# EAGLE design Davininci (EAGLE 5.04)
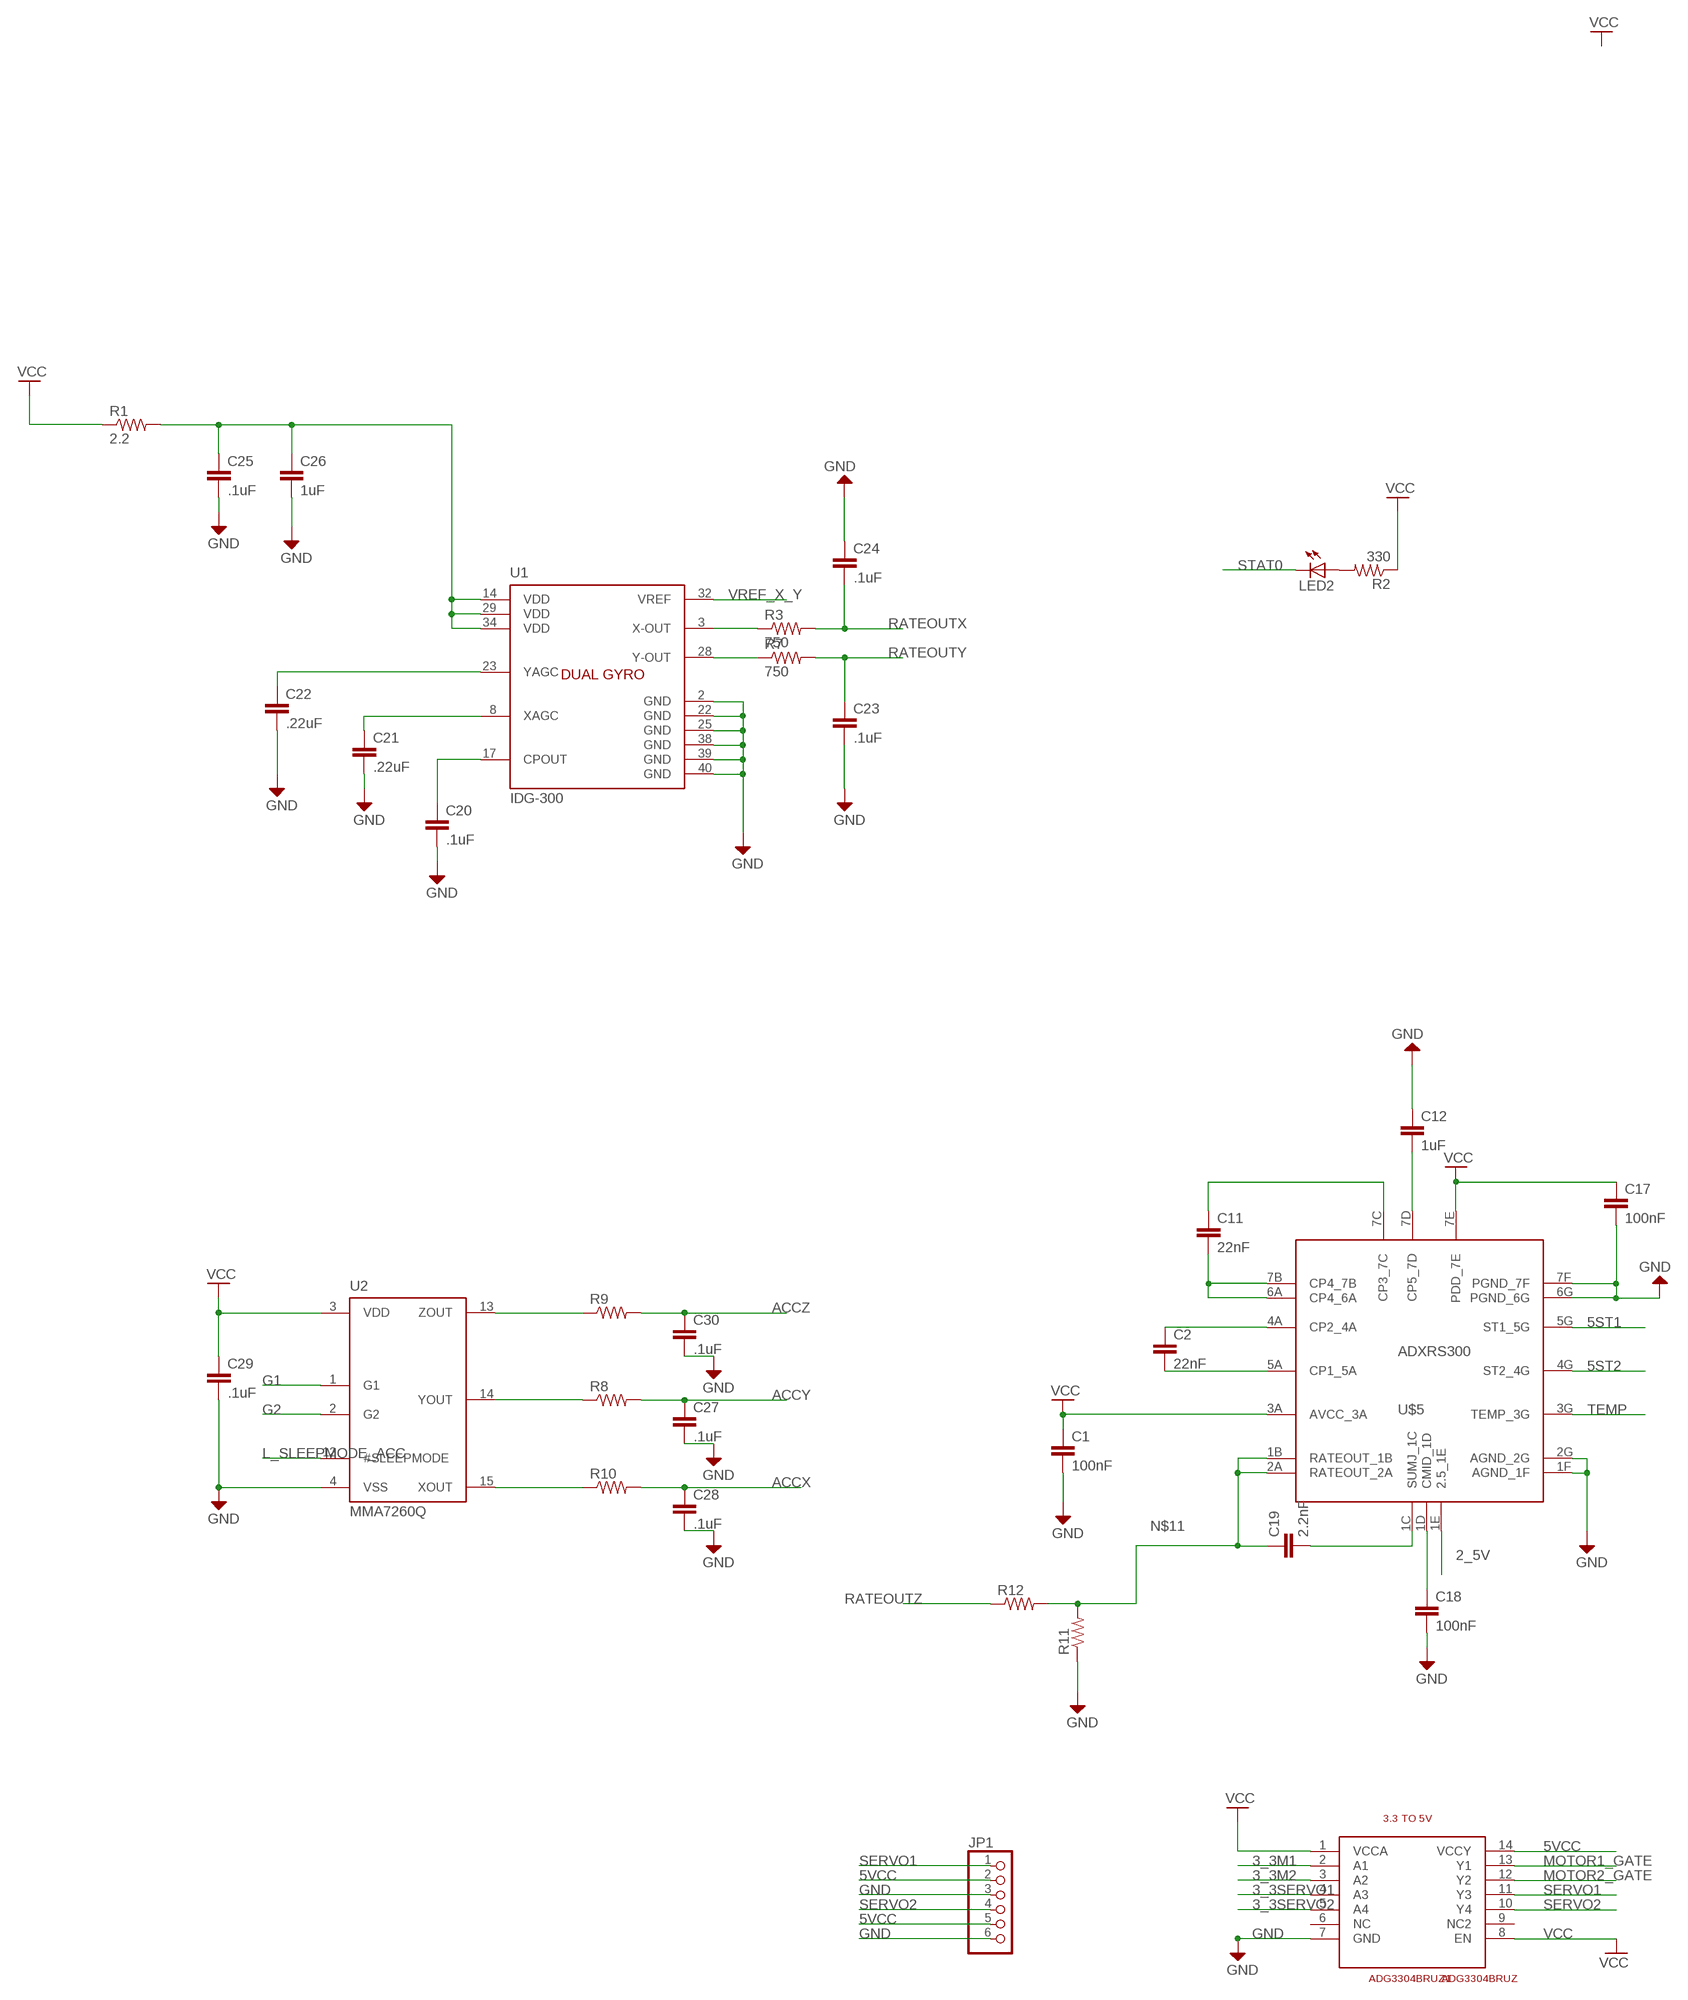
[diagram p0: schematic, sheet 1, part 1 of 2]
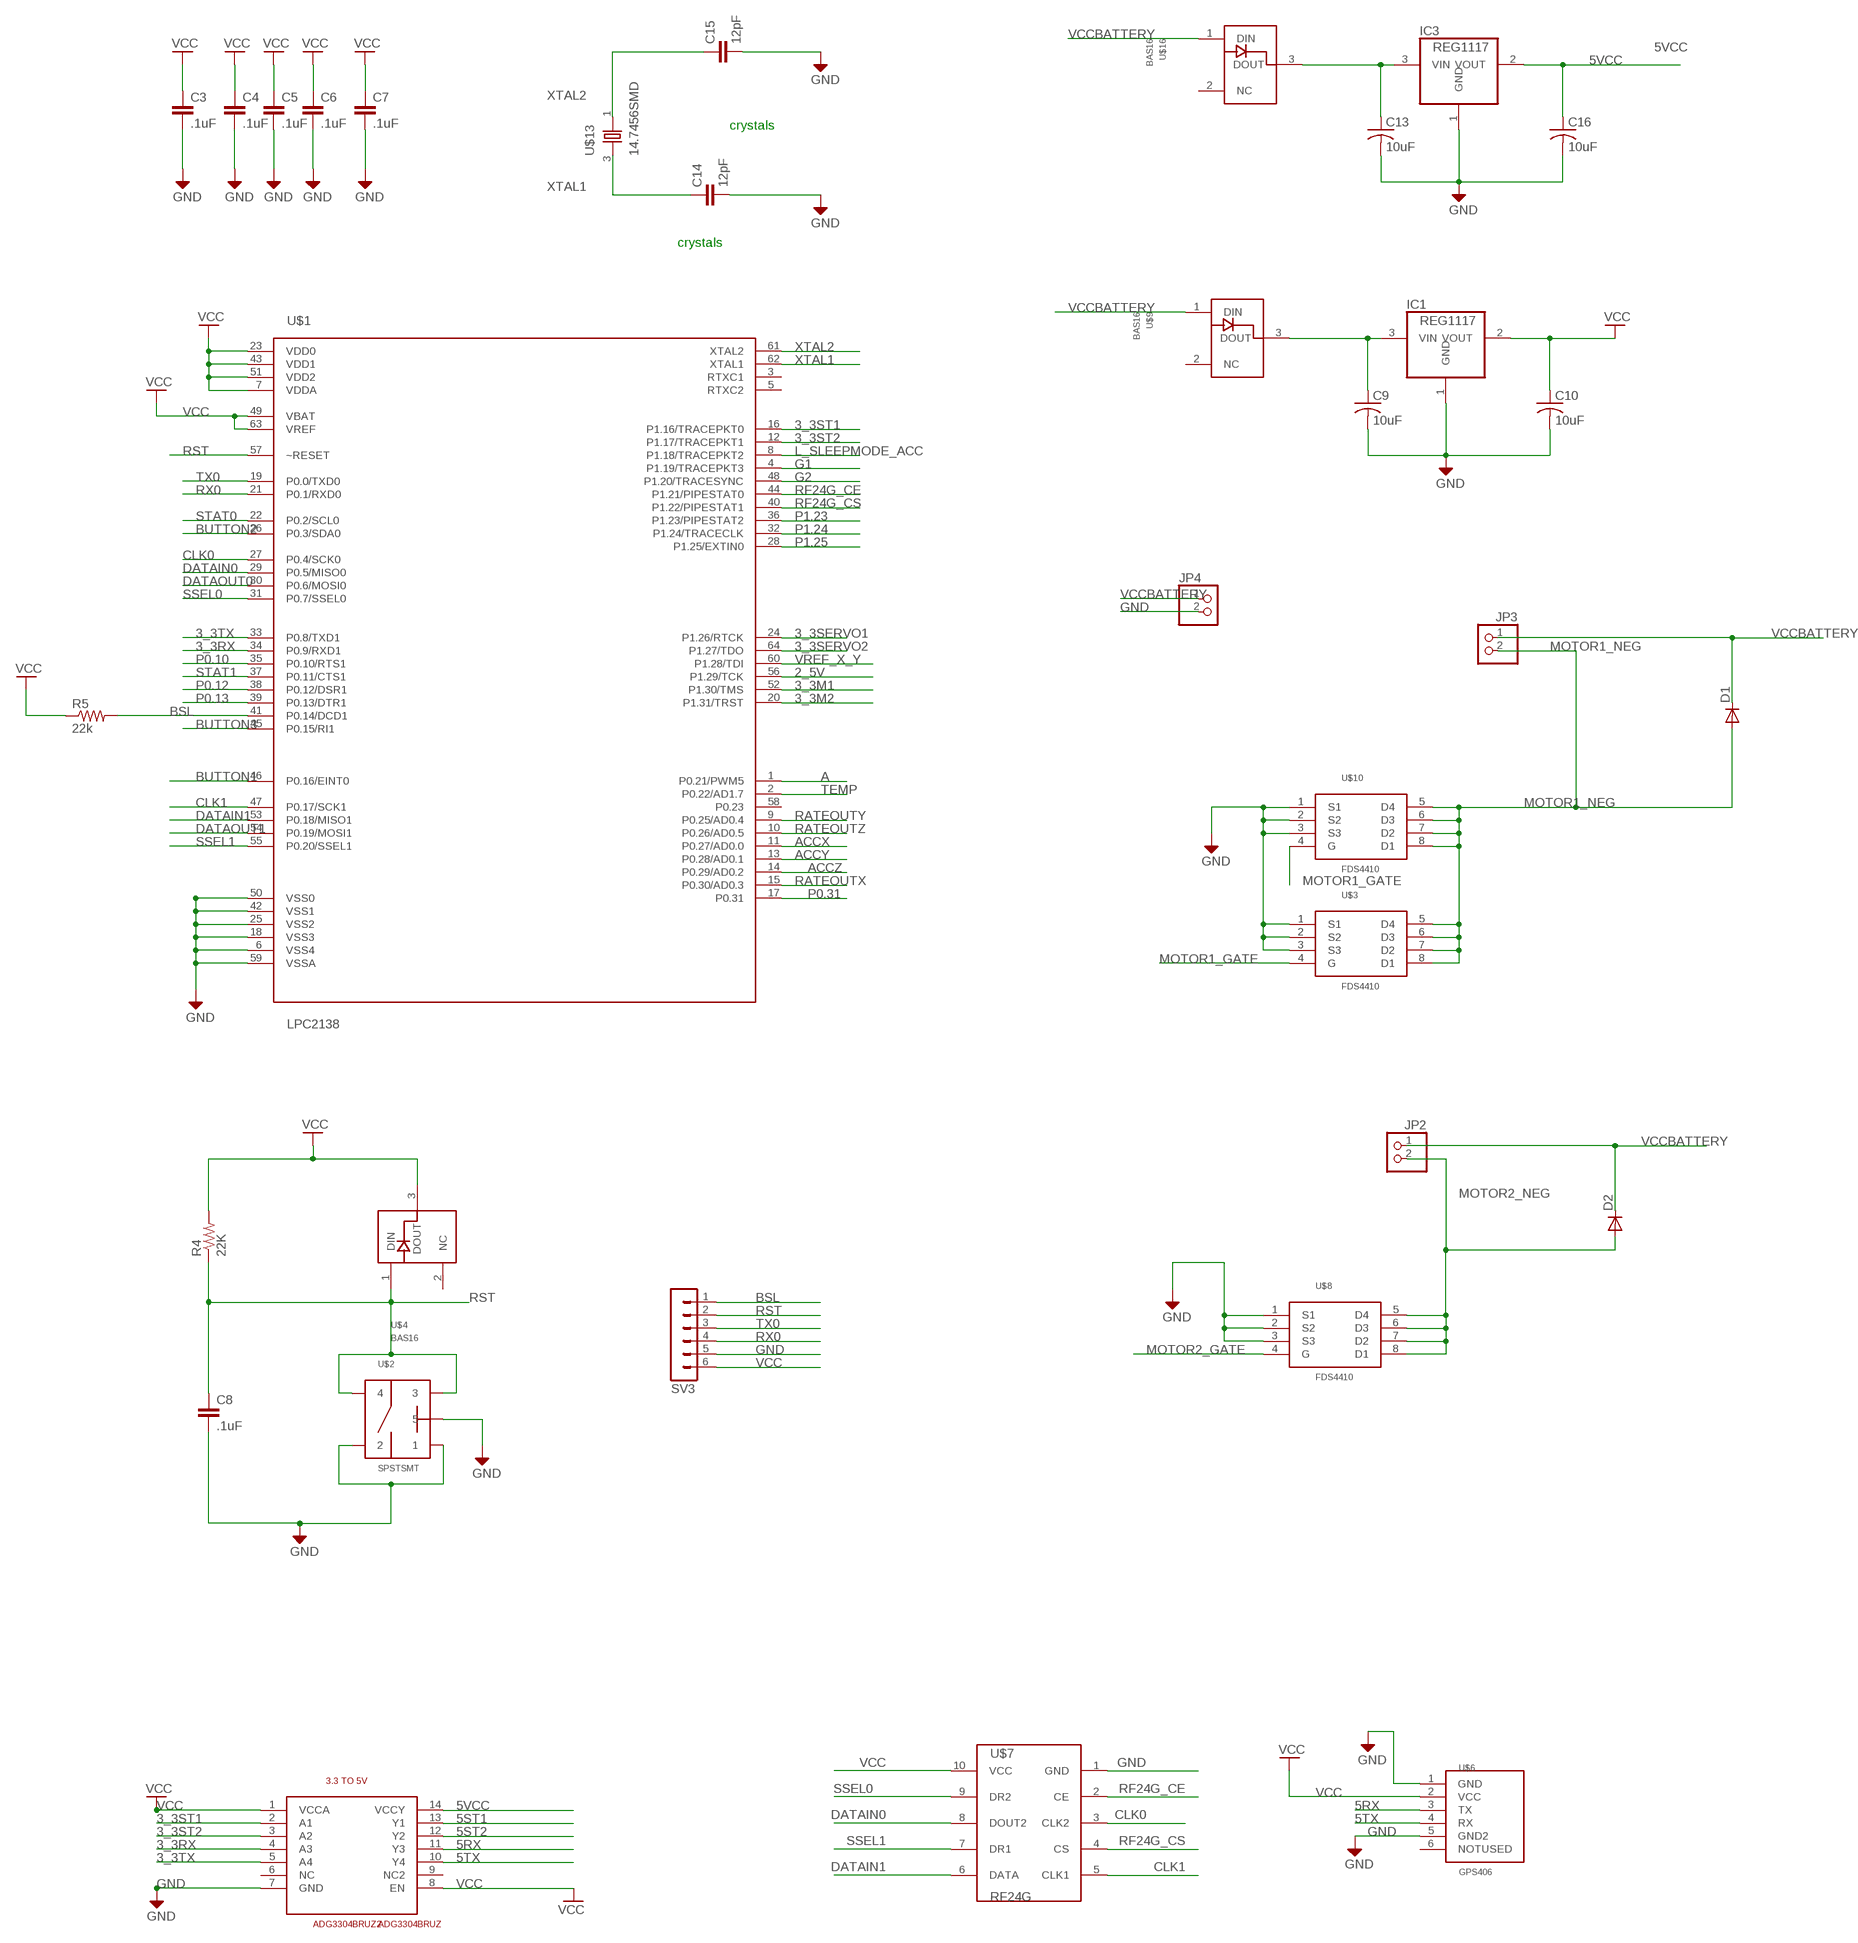
[diagram p1: schematic, sheet 1, part 2 of 2]

## Parts
ADG3304BRUZ1  ADG3304BRUZ  [TSSOP14]
ADG3304BRUZ2  ADG3304BRUZ  [TSSOP14]
C1  100nF  C-EUC0402  [C0402]
C2  22nF  C-EUC0402  [C0402]
C3  .1uF  C-EUC0402  [C0402]
C4  .1uF  C-EUC0402  [C0402]
C5  .1uF  C-EUC0402  [C0402]
C6  .1uF  C-EUC0402  [C0402]
C7  .1uF  C-EUC0402  [C0402]
C8  .1uF  C-EUC0402  [C0402]
C9  10uF  C-USC1206  [C1206]
C10  10uF  C-USC1206  [C1206]
C11  22nF  C-EUC0402  [C0402]
C12  1uF  C-EUC0402  [C0402]
C13  10uF  C-USC1206  [C1206]
C14  12pF  C-EUC0603  [C0603]
C15  12pF  C-EUC0603  [C0603]
C16  10uF  C-USC1206  [C1206]
C17  100nF  C-EUC0402  [C0402]
C18  100nF  C-EUC0402  [C0402]
C19  2.2nF  C-EUC0402  [C0402]
C20  .1uF  C-EUC0402  [C0402]
C21  .22uF  C-EUC0402  [C0402]
C22  .22uF  C-EUC0402  [C0402]
C23  .1uF  C-EUC0402  [C0402]
C24  .1uF  C-EUC0402  [C0402]
C25  .1uF  C-EUC0402  [C0402]
C26  1uF  C-EUC0402  [C0402]
C27  .1uF  C-EUC0402  [C0402]
C28  .1uF  C-EUC0402  [C0402]
C29  .1uF  C-EUC0402  [C0402]
C30  .1uF  C-EUC0402  [C0402]
D1  DIODE-DO214AC  [DO214AC]
D2  DIODE-DO214AC  [DO214AC]
IC1  REG1117  [SOT223]
IC3  REG1117  [SOT223]
JP1  PINHD-1X6  [1X06]
JP2  PINHD-1X2  [1X02]
JP3  PINHD-1X2  [1X02]
JP4  PINHD-1X2  [1X02]
LED2  LEDSMT1206  [1206]
R1  2.2  R-US_R0603  [R0603]
R2  330  R-US_R0603  [R0603]
R3  750  R-US_R0603  [R0603]
R4  22K  R-US_R0603  [R0603]
R5  22k  R-US_R0603  [R0603]
R7  750  R-US_R0603  [R0603]
R8  R-US_R0402  [R0402]
R9  R-US_R0402  [R0402]
R10  R-US_R0402  [R0402]
R11  R-US_R0402  [R0402]
R12  R-US_R0402  [R0402]
SV3  MA06-1  [MA06-1]
U1  IDG-300  [QFN-40]
U2  MMA7260Q  [QFN-16]
U$1  LPC2138  [LQFP64]
U$2  SPSTSMT  [SPSTSMT]
U$3  FDS4410  [SO-8]
U$4  BAS16  [SOT23]
U$5  ADXRS300  [CSPBGA_32]
U$6  GPS406  [GPS406CON]
U$7  RF24G  [RF24GCON]
U$8  FDS4410  [SO-8]
U$9  BAS16  [SOT23]
U$10  FDS4410  [SO-8]
U$13  14.7456SMD  [14.7456SMD]
U$16  BAS16  [SOT23]

## Nets
2_5V: U$1.56(P1.29/TCK) U$5.1E(2.5_1E)
3_3M1: ADG3304BRUZ1.2(A1) U$1.52(P1.30/TMS)
3_3M2: ADG3304BRUZ1.3(A2) U$1.20(P1.31/TRST)
3_3RX: ADG3304BRUZ2.4(A3) U$1.34(P0.9/RXD1)
3_3SERVO1: ADG3304BRUZ1.4(A3) U$1.24(P1.26/RTCK)
3_3SERVO2: ADG3304BRUZ1.5(A4) U$1.64(P1.27/TDO)
3_3ST1: ADG3304BRUZ2.2(A1) U$1.16(P1.16/TRACEPKT0)
3_3ST2: ADG3304BRUZ2.3(A2) U$1.12(P1.17/TRACEPKT1)
3_3TX: ADG3304BRUZ2.5(A4) U$1.33(P0.8/TXD1)
5RX: ADG3304BRUZ2.11(Y3) U$6.3(TX)
5ST1: ADG3304BRUZ2.13(Y1) U$5.5G(ST1_5G)
5ST2: ADG3304BRUZ2.12(Y2) U$5.4G(ST2_4G)
5TX: ADG3304BRUZ2.10(Y4) U$6.4(RX)
5VCC: ADG3304BRUZ1.14(VCCY) ADG3304BRUZ2.14(VCCY) C16.1 IC3.2(VOUT) JP1.2 JP1.5
A: U$1.1(P0.21/PWM5)
ACCX: C28.1 R10.2 U$1.11(P0.27/AD0.0)
ACCY: C27.1 R8.2 U$1.13(P0.28/AD0.1)
ACCZ: C30.1 R9.2 U$1.14(P0.29/AD0.2)
BSL: R5.2 SV3.1 U$1.41(P0.14/DCD1)
BUTTON1: U$1.46(P0.16/EINT0)
BUTTON2: U$1.26(P0.3/SDA0)
BUTTON3: U$1.45(P0.15/RI1)
CLK0: U$1.27(P0.4/SCK0) U$7.3(CLK2)
CLK1: U$1.47(P0.17/SCK1) U$7.5(CLK1)
DATAIN0: U$1.29(P0.5/MISO0) U$7.8(DOUT2)
DATAIN1: U$1.53(P0.18/MISO1) U$7.6(DATA)
DATAOUT0: U$1.30(P0.6/MOSI0)
DATAOUT1: U$1.54(P0.19/MOSI1)
G1: U2.1(G1) U$1.4(P1.19/TRACEPKT3)
G2: U2.2(G2) U$1.48(P1.20/TRACESYNC)
GND: ADG3304BRUZ1.7(GND) ADG3304BRUZ2.7(GND) C1.2 C3.2 C4.2 C5.2 C6.2 C7.2 C8.2 C9.2 C10.2 C12.1 C13.2 C14.2 C15.2 C16.2 C17.2 C18.2 C20.2 C21.2 C22.2 C23.2 C24.1 C25.2 C26.2 C27.2 C28.2 C29.2 C30.2 IC1.1(GND) IC3.1(GND) JP1.3 JP1.6 JP4.2 R11.1 SV3.5 U1.2(GND) U1.22(GND) U1.25(GND) U1.38(GND) U1.39(GND) U1.40(GND) U2.4(VSS) U$1.6(VSS4) U$1.18(VSS3) U$1.25(VSS2) U$1.42(VSS1) U$1.50(VSS0) U$1.59(VSSA) U$2.1 U$2.2 U$2.5 U$3.1(S1) U$3.2(S2) U$3.3(S3) U$5.1F(AGND_1F) U$5.2G(AGND_2G) U$5.6G(PGND_6G) U$5.7F(PGND_7F) U$6.1(GND) U$6.5(GND2) U$7.1(GND) U$8.1(S1) U$8.2(S2) U$8.3(S3) U$10.1(S1) U$10.2(S2) U$10.3(S3)
L_SLEEPMODE_ACC: U2.12(#SLEEPMODE) U$1.8(P1.18/TRACEPKT2)
MOTOR1_GATE: ADG3304BRUZ1.13(Y1) U$3.4(G) U$10.4(G)
MOTOR1_NEG: D1.A JP3.2 U$3.5(D4) U$3.6(D3) U$3.7(D2) U$3.8(D1) U$10.5(D4) U$10.6(D3) U$10.7(D2) U$10.8(D1)
MOTOR2_GATE: ADG3304BRUZ1.12(Y2) U$8.4(G)
MOTOR2_NEG: D2.A JP2.2 U$8.5(D4) U$8.6(D3) U$8.7(D2) U$8.8(D1)
N$1: C25.1 C26.1 R1.2 U1.14(VDD) U1.29(VDD) U1.34(VDD)
N$2: C2.2 U$5.5A(CP1_5A)
N$3: C2.1 U$5.4A(CP2_4A)
N$4: C11.2 U$5.6A(CP4_6A) U$5.7B(CP4_7B)
N$5: C11.1 U$5.7C(CP3_7C)
N$6: C12.2 U$5.7D(CP5_7D)
N$7: R7.1 U1.28(Y-OUT)
N$8: LED2.A R2.2
N$9: R3.1 U1.3(X-OUT)
N$11: C19.1 R11.2 R12.2 U$5.1B(RATEOUT_1B) U$5.2A(RATEOUT_2A)
N$12: C22.1 U1.23(YAGC)
N$13: C19.2 U$5.1C(SUMJ_1C)
N$15: C18.1 U$5.1D(CMID_1D)
N$16: C21.1 U1.8(XAGC)
N$18: C13.1 IC3.3(VIN) U$16.3(DOUT)
N$19: C20.1 U1.17(CPOUT)
N$23: C9.1 IC1.3(VIN) U$9.3(DOUT)
N$27: R9.1 U2.13(ZOUT)
N$28: R8.1 U2.14(YOUT)
N$29: R10.1 U2.15(XOUT)
P0.10: U$1.35(P0.10/RTS1)
P0.12: U$1.38(P0.12/DSR1)
P0.13: U$1.39(P0.13/DTR1)
P0.31: U$1.17(P0.31)
P1.23: U$1.36(P1.23/PIPESTAT2)
P1.24: U$1.32(P1.24/TRACECLK)
P1.25: U$1.28(P1.25/EXTIN0)
RATEOUTX: C24.2 R3.2 U$1.15(P0.30/AD0.3)
RATEOUTY: C23.1 R7.2 U$1.9(P0.25/AD0.4)
RATEOUTZ: R12.1 U$1.10(P0.26/AD0.5)
RF24G_CE: U$1.44(P1.21/PIPESTAT0) U$7.2(CE)
RF24G_CS: U$1.40(P1.22/PIPESTAT1) U$7.4(CS)
RST: C8.1 R4.1 SV3.2 U$1.57(~RESET) U$2.3 U$2.4 U$4.1(DIN)
RX0: SV3.4 U$1.21(P0.1/RXD0)
SERVO1: ADG3304BRUZ1.11(Y3) JP1.1
SERVO2: ADG3304BRUZ1.10(Y4) JP1.4
SSEL0: U$1.31(P0.7/SSEL0) U$7.9(DR2)
SSEL1: U$1.55(P0.20/SSEL1) U$7.7(DR1)
STAT0: LED2.C U$1.22(P0.2/SCL0)
STAT1: U$1.37(P0.11/CTS1)
TEMP: U$1.2(P0.22/AD1.7) U$5.3G(TEMP_3G)
TX0: SV3.3 U$1.19(P0.0/TXD0)
VCC: ADG3304BRUZ1.1(VCCA) ADG3304BRUZ1.8(EN) ADG3304BRUZ2.1(VCCA) ADG3304BRUZ2.8(EN) C1.1 C3.1 C4.1 C5.1 C6.1 C7.1 C10.1 C17.1 C29.1 IC1.2(VOUT) R1.1 R2.1 R4.2 R5.1 SV3.6 U2.3(VDD) U$1.7(VDDA) U$1.23(VDD0) U$1.43(VDD1) U$1.49(VBAT) U$1.51(VDD2) U$1.63(VREF) U$4.3(DOUT) U$5.3A(AVCC_3A) U$5.7E(PDD_7E) U$6.2(VCC) U$7.10(VCC)
VCCBATTERY: D1.C D2.C JP2.1 JP3.1 JP4.1 U$9.1(DIN) U$16.1(DIN)
VREF_X_Y: U1.32(VREF) U$1.60(P1.28/TDI)
XTAL1: C14.1 U$1.62(XTAL1) U$13.3
XTAL2: C15.1 U$1.61(XTAL2) U$13.1
Unconnected: ADG3304BRUZ1.6(NC) ADG3304BRUZ1.9(NC2) ADG3304BRUZ2.6(NC) ADG3304BRUZ2.9(NC2) U1.1(RESV) U1.4(NC) U1.5(NC) U1.6(NC) U1.7(NC) U1.9(RESV) U1.10(RESV) U1.11(RESV) U1.12(RESV) U1.13(RESV) U1.15(RESV) U1.16(RESV) U1.18(RESV) U1.19(RESV) U1.20(RESV) U1.21(RESV) U1.24(NC) U1.26(NC) U1.27(NC) U1.30(RESV) U1.31(RESV) U1.33(RESV) U1.35(RESV) U1.36(RESV) U1.37(RESV) U$1.3(RTXC1) U$1.5(RTXC2) U$1.58(P0.23) U$4.2(NC) U$6.6(NOTUSED) U$9.2(NC) U$16.2(NC)

## Notes on the sheet
- crystals
- crystals

## Library data of the parts
ADG3304BRUZ1 ADG3304BRUZ2 = TXCVR:ADG3304BRUZ
C1-C8 C11 C12 C14 C15 C17-C30 = rcl:C-EU: CAPACITOR, European symbol
C9 C10 C13 C16 = rcl:C-US: CAPACITOR, American symbol
D1 D2 = diode:DIODE-: DIODE
IC1 IC3 = burr-brown:REG1117: 800mA and 1A Low Dropout (LDO) Positive Regulator 1.8V, 2.5V, 2.85V, 3.3V, 5V, and Adj
JP1 = pinhead:PINHD-1X6: PIN HEADER
JP2-JP4 = pinhead:PINHD-1X2: PIN HEADER
LED2 = led:LED: LED OSRAM: - CHIPLED LG R971, LG N971, LY N971, LG Q971, LY Q971, LO R971, LY R971 LH N974, LH R974 LS Q976, LO Q976, LY Q976 LO Q996 - Hyper CHIPLED LW Q18S LB Q993, LB Q99A, LB R99A - SideLED LS A670, LO A670, LY A670, LG A670, LP A670 LB A673, LV A673, LT A673, LW A673 LH A674 LY A675 LS A676, LA A676, LO A676, LY A676, LW A676 LS A679, LY A679, LG A679 - Hyper Micro SIDELED® LS Y876, LA Y876, LO Y876, LY Y876 LT Y87S - SmartLED LW L88C, LW L88S LB L89C, LB L89S, LG L890 LS L89K, LO L89K, LY L89K LS L896, LA L896, LO L896, LY L896 - TOPLED LS T670, LO T670, LY T670, LG T670, LP T670 LSG T670, LSP T670, LSY T670, LOP T670, LYG T670 LG T671, LOG T671, LSG T671 LB T673, LV T673, LT T673, LW T673 LH T674 LS T676, LA T676, LO T676, LY T676, LB T676, LH T676, LSB T676, LW T676 LB T67C, LV T67C, LT T67C, LS T67K, LO T67K, LY T67K, LW E67C LS E67B, LA E67B, LO E67B, LY E67B, LB E67C, LV E67C, LT E67C LW T67C LS T679, LY T679, LG T679 LS T770, LO T770, LY T770, LG T770, LP T770 LB T773, LV T773, LT T773, LW T773 LH T774 LS E675, LA E675, LY E675, LS T675 LS T776, LA T776, LO T776, LY T776, LB T776 LHGB T686 LT T68C, LB T68C - Hyper Mini TOPLED® LB M676 - Mini TOPLED Santana® LG M470 LS M47K, LO M47K, LY M47K Source: http://www.osram.convergy.de/
R1-R5 R7-R12 = rcl:R-US_: RESISTOR, American symbol
SV3 = con-lstb:MA06-1: PIN HEADER
U1 = m-pad-2.0:IDG-300: InvenSense's IDG-300 Integrated Dual-Axis Gyro Description: The IDG-300 is an integrated dual-axis angular rate sensor (gyroscope). It uses InvenSense?s proprietary and patented MEMS technology with vertically driven, vibrating masses to make a functionally complete, lowcost, dual-axis angular rate sensor. All required electronics are integrated onto a single chip with the sensor. The IDG-300 gyro uses two sensor elements with novel vibrating dual-mass bulk silicon configurations that sense the rate of rotation about the X- and Y-axis (in-plane sensing). This results in a unique, integrated dual-axis gyro with guaranteed-by-design vibration rejection and high cross-axis isolation. It is specifically designed for demanding consumer applications requiring low cost, small size and high performance. The IDG-300 gyro includes integrated electronics necessary for application-ready functionality. It incorporates X- and Y-axis low-pass filters and an EEPROM for on-chip factory calibration of the sensor. Factory trimmed scale factors eliminate the need for external active components and end-user calibration. This product is lead-free and Green Compliant. Features: Integrated X- and Y-axis gyro on a single chip Factory trimmed full scale range of ±500°/sec Integrated low-pass filters Superior vibration rejection over a wide frequency range High cross-axis isolation by design 3V single supply operation 5000 g shock tolerance RoHS compliant (completely lead free) 6 x 6 x 1.5mm QFN package Applications: Inertial measurement units (IMUs) Handheld GPS navigation devices Radio controlled helicopters Toys and game consoles Robotic and power tools Antenna positioning Remote control Please send any comments to: messi@users.sourceforge.net
U2 = m-pad-2.0:MMA7260Q: Freescale Semiconductor's MMA7260Q ±1.5g - 6g Three Axis Low-g Micromachined Accelerometer Description: The MMA7260Q low cost capacitive micromachined accelerometer features signal conditioning, a 1-pole low pass filter, temperature compensation and g-Select which allows for the selection among 4 sensitivities. Zero-g offset full scale span and filter cut-off are factory set and require no external devices. Includes a Sleep Mode that makes it ideal for handheld battery powered electronics. Features: Selectable Sensitivity (1.5g/2g/4g/6g) Low Current Consumption: 500 µA Sleep Mode: 3 µA Low Voltage Operation: 2.2 V  3.6 V 6mm x 6mm x 1.45mm QFN High Sensitivity (800 mV/g @1.5 g) Fast Turn On Time High Sensitivity (1.5 g) Integral Signal Conditioning with Low Pass Filter Robust Design, High Shocks Survivability Pb-Free Terminations Environmentally Preferred Package Low Cost Typical Applications: HDD MP3 Player : Freefall Detection Laptop PC : Freefall Detection, Anti-Theft Cell Phone : Image Stability, Text Scroll, Motion Dialing, E-Compass Pedometer : Motion Sensing PDA : Text Scroll Navigation and Dead Reckoning : E-Compass Tilt Compensation Gaming : Tilt and Motion Sensing, Event Recorder Robotics : Motion Sensing Please send any comments to: messi@users.sourceforge.net
U$1 = m-pad-2.0:LPC2138
U$2 = m-pad-2.0:SPSTSMT
U$3 U$8 U$10 = m-pad-2.0:FDS4410
U$4 U$9 U$16 = TXCVR:BAS16
U$5 = analog-devices:ADXRS300
U$6 = m-pad-2.0:GPS406
U$7 = m-pad-2.0:RF24G
U$13 = m-pad-2.0:14.7456SMD

## Board
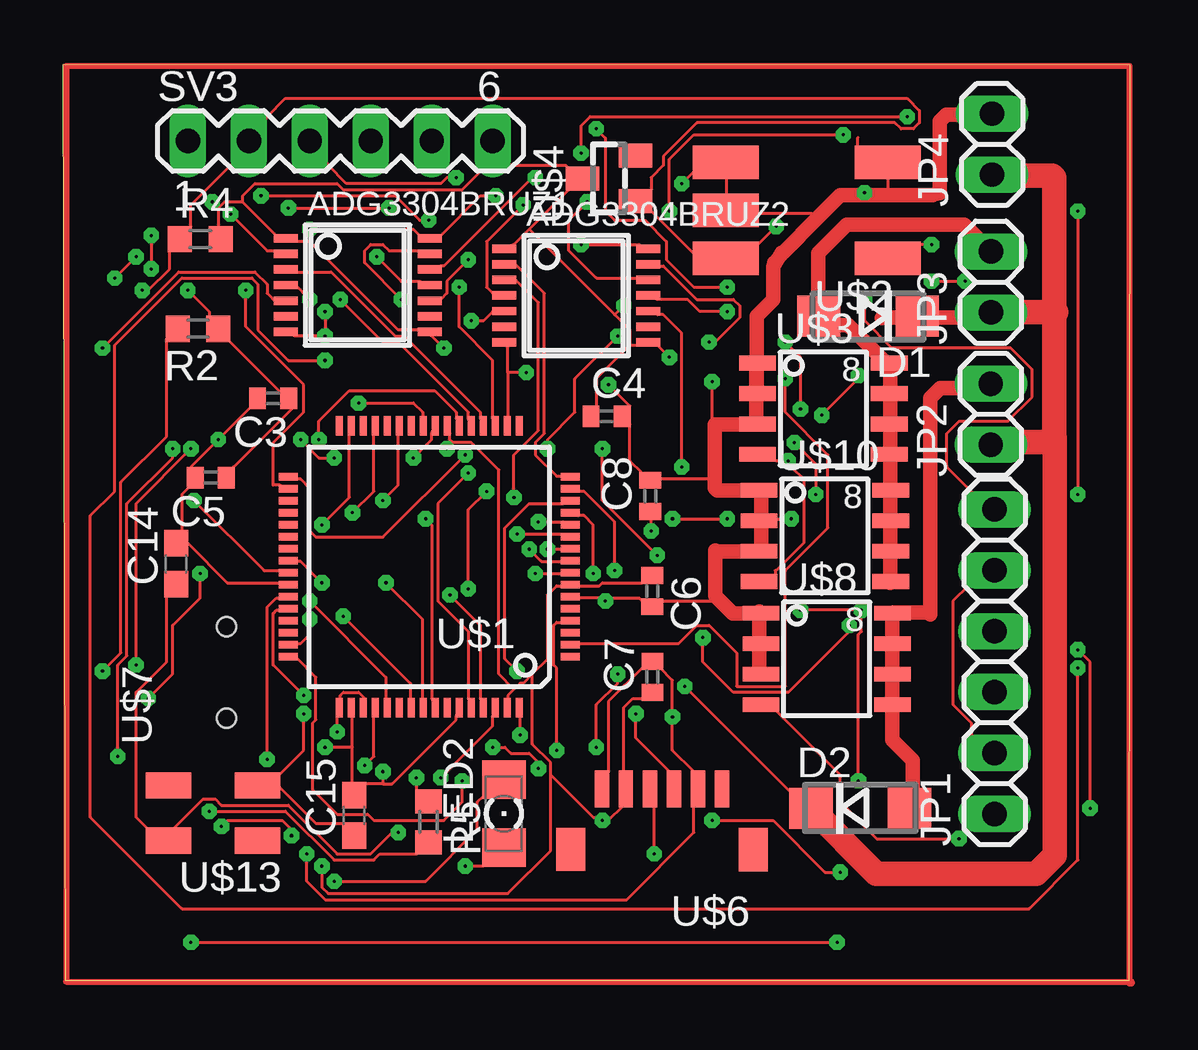
[diagram p2: board, top side]
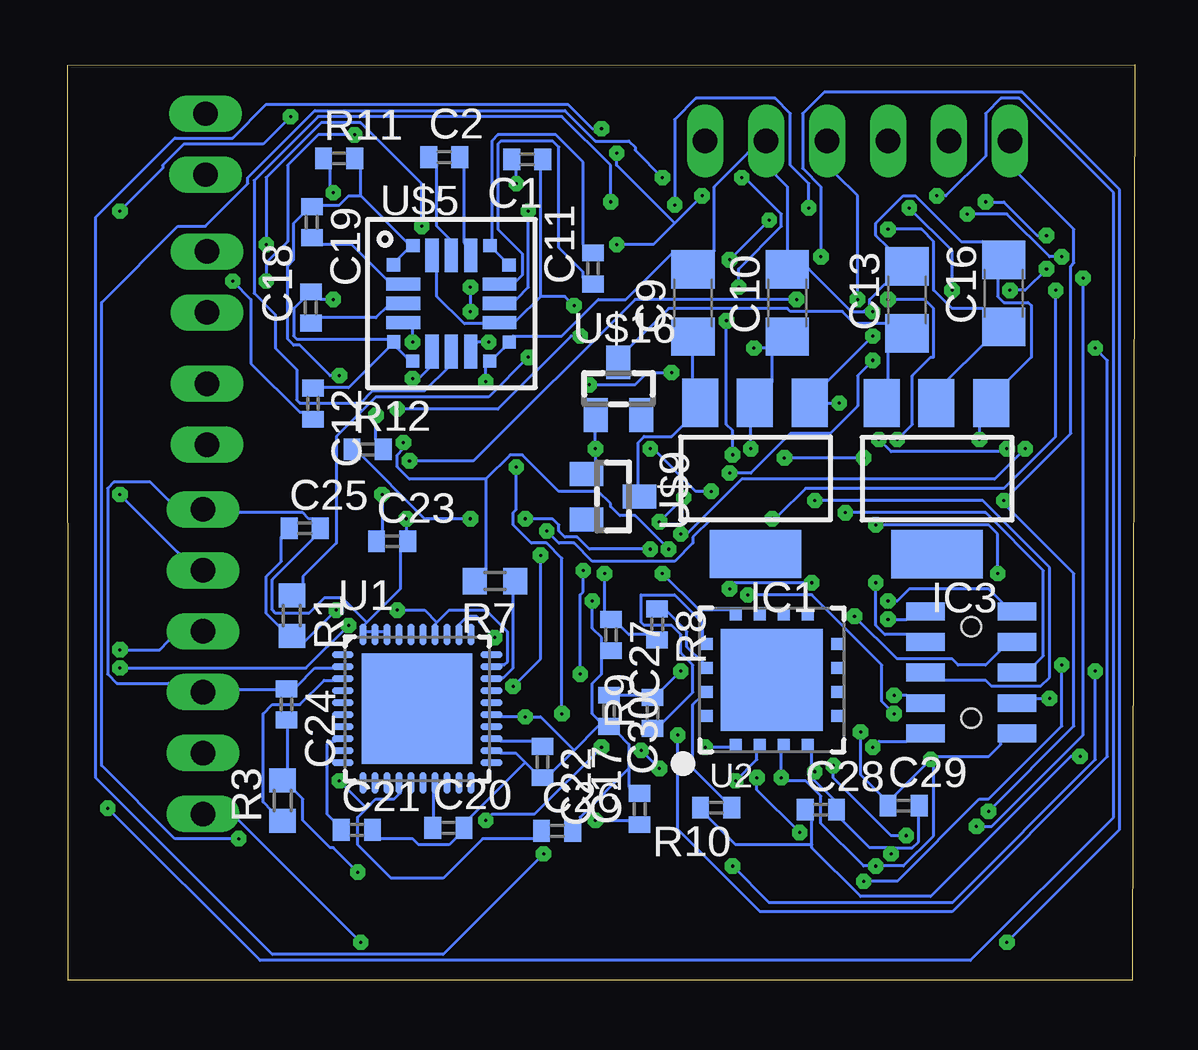
[diagram p3: board, bottom side, seen from below]

Size 44.46 x 38.17 mm. Coordinates in mm from the lower left corner, seen from the top.
Outline: 0.1,0.02 44.44,0 44.46,38.15 0,38.17 0.1,0.02
Copper layers (1*16): Top 0.035mm / dielectric 1.5mm / Bottom 0.035mm
Design rules "default": minimum track width 5mil, minimum drill 5mil, track to track 5mil, track to pad 5mil, pad to pad 5mil, via to via 5mil, smd to smd 5mil, copper to edge 40mil, drill to drill 5mil, minimum pad ring 10mil, minimum via ring 10mil, stop-mask expansion 4mil, vias tented up to drill 0mil, thermal gap 10mil

### Footprints (pad centres in the part's own frame; a part is rotated, then mirrored left to right if it is on the bottom)
TSSOP14 = smd 0.35 x 1: 1 -1.95,-3; 2 -1.3,-3; 3 -0.65,-3; 4 0,-3; 5 0.65,-3; 6 1.3,-3; 7 1.95,-3; 8 1.95,3; 9 1.3,3; 10 0.65,3; 11 0,3; 12 -0.65,3; 13 -1.3,3; 14 -1.95,3
C0402 = smd 0.7 x 0.9: 1 -0.65,0; 2 0.65,0
C1206 = smd 1.6 x 1.8: 1 -1.4,0; 2 1.4,0
C0603 = smd 1.1 x 1: 1 -0.85,0; 2 0.85,0
DO214AC = smd 1.8 x 1.7: A 2.05,0; C -2.05,0
SOT223 = smd 1.499 x 2.007: 1 -2.261,-3.15; 2 0.025,-3.15; 3 2.311,-3.15 | smd 3.81 x 2.007: 4 0,3.15
1X06 = drill 1.016 long: 1 -6.35,0; 2 -3.81,0; 3 -1.27,0; 4 1.27,0; 5 3.81,0; 6 6.35,0
1X02 = drill 1.016 long: 1 -1.27,0; 2 1.27,0
1206 = smd 1.6 x 1.803: A -1.422,0; C 1.422,0
R0603 = smd 1 x 1.1: 1 -0.85,0; 2 0.85,0
R0402 = smd 0.7 x 0.9: 1 -0.65,0; 2 0.65,0
MA06-1 = drill 1.016 long: 1 -6.35,0; 2 -3.81,0; 3 -1.27,0; 4 1.27,0; 5 3.81,0; 6 6.35,0
QFN-40 = smd 0.9 x 0.3: 1 -3.1,2.25; 2 -3.1,1.75; 3 -3.1,1.25; 4 -3.1,0.75; 5 -3.1,0.25; 6 -3.1,-0.25; 7 -3.1,-0.75; 8 -3.1,-1.25; 9 -3.1,-1.75; 10 -3.1,-2.25; 21 3.1,-2.25; 22 3.1,-1.75; 23 3.1,-1.25; 24 3.1,-0.75; 25 3.1,-0.25; 26 3.1,0.25; 27 3.1,0.75; 28 3.1,1.25; 29 3.1,1.75; 30 3.1,2.25 | smd 0.3 x 0.9: 11 -2.25,-3.1; 12 -1.75,-3.1; 13 -1.25,-3.1; 14 -0.75,-3.1; 15 -0.25,-3.1; 16 0.25,-3.1; 17 0.75,-3.1; 18 1.25,-3.1; 19 1.75,-3.1; 20 2.25,-3.1; 31 2.25,3.1; 32 1.75,3.1; 33 1.25,3.1; 34 0.75,3.1; 35 0.25,3.1; 36 -0.25,3.1; 37 -0.75,3.1; 38 -1.25,3.1; 39 -1.75,3.1; 40 -2.25,3.1 | smd 4.6 x 4.6: P$1 0,0
QFN-16 = smd 0.5 x 0.55: 1 -1.5,-2.75; 2 -0.5,-2.75; 3 0.5,-2.75; 4 1.5,-2.75; 9 1.5,2.75; 10 0.5,2.75; 11 -0.5,2.75; 12 -1.5,2.75 | smd 0.55 x 0.5: 5 2.75,-1.5; 6 2.75,-0.5; 7 2.75,0.5; 8 2.75,1.5; 13 -2.75,1.5; 14 -2.75,0.5; 15 -2.75,-0.5; 16 -2.75,-1.5 | smd 4.25 x 4.25: P$1 0,0
LQFP64 = smd 0.8 x 0.3: 1 -5.875,3.75; 2 -5.875,3.25; 3 -5.875,2.75; 4 -5.875,2.25; 5 -5.875,1.75; 6 -5.875,1.25; 7 -5.875,0.75; 8 -5.875,0.25; 9 -5.875,-0.25; 10 -5.875,-0.75; 11 -5.875,-1.25; 12 -5.875,-1.75; 13 -5.875,-2.25; 14 -5.875,-2.75; 15 -5.875,-3.25; 16 -5.875,-3.75; 33 5.875,-3.75; 34 5.875,-3.25; 35 5.875,-2.75; 36 5.875,-2.25; 37 5.875,-1.75; 38 5.875,-1.25; 39 5.875,-0.75; 40 5.875,-0.25; 41 5.875,0.25; 42 5.875,0.75; 43 5.875,1.25; 44 5.875,1.75; 45 5.875,2.25; 46 5.875,2.75; 47 5.875,3.25; 48 5.875,3.75 | smd 0.3 x 0.8: 17 -3.75,-5.875; 18 -3.25,-5.875; 19 -2.75,-5.875; 20 -2.25,-5.875; 21 -1.75,-5.875; 22 -1.25,-5.875; 23 -0.75,-5.875; 24 -0.25,-5.875; 25 0.25,-5.875; 26 0.75,-5.875; 27 1.25,-5.875; 28 1.75,-5.875; 29 2.25,-5.875; 30 2.75,-5.875; 31 3.25,-5.875; 32 3.75,-5.875; 49 3.75,5.875; 50 3.25,5.875; 51 2.75,5.875; 52 2.25,5.875; 53 1.75,5.875; 54 1.25,5.875; 55 0.75,5.875; 56 0.25,5.875; 57 -0.25,5.875; 58 -0.75,5.875; 59 -1.25,5.875; 60 -1.75,5.875; 61 -2.25,5.875; 62 -2.75,5.875; 63 -3.25,5.875; 64 -3.75,5.875
SPSTSMT = smd 2.75 x 1.4: 1 3.376,-2.001; 2 -3.377,-2.005; 3 3.376,2.001; 4 -3.377,2.005; 5 3.376,0
SO-8 = smd 1.524 x 0.61: 1 -2.743,1.27; 2 -2.743,0; 3 -2.743,-1.27; 4 -2.743,-2.54; 5 2.743,-2.54; 6 2.743,-1.27; 7 2.743,0; 8 2.743,1.27
SOT23 = smd 1 x 1.4: 1 -0.95,-1.1; 2 0.95,-1.1; 3 0,1.1
CSPBGA_32 = smd 0.55 x 0.55: 1B -2.407,1.607; 1F -2.405,-1.601; 2A -1.601,2.405; 2G -1.607,-2.407; 6A 1.607,2.407; 6G 1.601,-2.405; 7B 2.405,1.601; 7F 2.407,-1.607 | smd 1.4 x 0.55: 1C -2.004,0.804; 1D -2.004,0; 1E -2.004,-0.804; 7C 2.004,0.804; 7D 2.004,0; 7E 2.004,-0.804 | smd 0.55 x 1.4: 3A -0.804,2.004; 3G -0.804,-2.004; 4A 0,2.004; 4G 0,-2.004; 5A 0.804,2.004; 5G 0.804,-2.004
GPS406CON = smd 0.6 x 1.55: 1 3.003,0; 2 2.009,0; 3 1.004,0; 4 0,0; 5 -1.004,0; 6 -2.009,0 | smd 1.2 x 1.8: P$1 -3.305,2.528; P$8 4.306,2.523
RF24GCON = smd 0.74 x 1.6 bottom: 1 -2.541,-1.909; 2 -1.277,-1.909; 3 0,-1.909; 4 1.277,-1.909; 5 2.541,-1.909; 6 2.541,1.909; 7 1.277,1.909; 8 0,1.909; 9 -1.277,1.909; 10 -2.541,1.909 | hole 0.8: 1.907,0; -1.906,0
14.7456SMD = smd 1.9 x 1.1: 1 -1.852,-1.152; 2 1.852,-1.152; 3 1.852,1.152; 4 -1.852,1.152

### Placement (x,y rotation side)
ADG3304BRUZ1  12.27,28.99 270 top
ADG3304BRUZ2  21.39,28.55 270 top
C1  25.31,34.23 180 bottom
C2  28.77,34.32 0 bottom
C3  8.75,24.27 180 top
C4  22.65,23.52 0 top
C5  6.15,20.96 180 top
C6  24.55,16.23 270 top
C7  24.56,12.65 90 top
C8  24.47,20.2 90 top
C9  18.41,28.24 90 bottom
C10  14.48,28.24 90 bottom
C11  22.58,29.68 90 bottom
C12  34.24,24.05 270 bottom
C13  9.49,28.37 90 bottom
C14  4.72,17.37 90 top
C15  12.13,6.88 90 top
C16  5.46,28.65 90 bottom
C17  20.63,7.15 90 bottom
C18  34.33,28.05 90 bottom
C19  34.29,31.61 270 bottom
C20  28.6,6.36 0 bottom
C21  32.41,6.28 0 bottom
C22  24.68,9.1 270 bottom
C23  30.94,18.3 0 bottom
C24  35.35,11.51 270 bottom
C25  34.59,18.85 0 bottom
C26  24.07,6.24 0 bottom
C27  21.83,14.4 270 bottom
C28  13.08,7.12 0 bottom
C29  9.63,7.29 0 bottom
C30  21.91,11.25 270 bottom
D1  33.54,27.7 180 top
D2  33.22,7.17 0 top
IC1  15.8,20.93 180 bottom
IC3  8.24,20.92 180 bottom
JP1  38.82,13.29 90 top
JP2  38.66,23.61 90 top
JP3  38.67,29.12 90 top
JP4  38.71,34.86 90 top
LED2  18.37,6.96 90 top
R1  35.12,15.2 270 bottom
R2  5.62,27.17 180 top
R3  35.51,7.5 90 bottom
R4  5.72,30.9 0 top
R5  15.23,6.61 270 top
R7  26.66,16.65 180 bottom
R8  19.9,14.84 270 bottom
R9  20.09,11.15 90 bottom
R10  17.44,7.2 180 bottom
R11  33.16,34.27 0 bottom
R12  31.97,22.14 0 bottom
SV3  11.55,35 0 top
U1  29.9,11.33 0 bottom
U2  15.12,12.54 0 bottom
U$1  15.26,17.24 180 top
U$2  30.99,32.1 180 top
U$3  31.68,24.47 0 top
U$4  22.75,33.43 90 top
U$5  28.48,28.22 0 bottom
U$6  25.46,7.99 180 top
U$7  6.82,12.84 90 top
U$8  31.82,14.04 0 top
U$9  21.74,20.17 270 bottom
U$10  31.75,19.17 0 top
U$13  6.25,6.98 180 top
U$16  21.52,24.67 0 bottom

### Tracks (layer width: path | path; a pad name or v marks a point on that pad's centre or on a via)
2_5V  (via drill 0.13)
  Top 0.127: v13.46,16.58 14.98,15.06 14.98,11.75 U$1.56 | v16.89,16.33 16.89,19.63 v17.65,20.39 | v20.19,22.17 20.19,22.55 21.33,23.69 21.33,25.09 v23.11,26.87 | v30.73,23.82 30.73,25.98 v30.1,26.61
  Bottom 0.127: v13.46,16.58 16.89,16.58 v16.89,16.33 | v17.65,20.39 18.28,20.39 20.06,22.17 v20.19,22.17 | v23.11,26.87 23.49,26.87 26.54,23.82 v30.73,23.82 | v30.1,26.61 30.1,27.25 U$5.1E
3_3M1  (via drill 0.13)
  Top 0.127: v12.57,8.96 12.95,9.34 12.95,10.99 U$1.52 | v9.52,6.04 9.52,6.29 9.14,6.67 6.85,6.67 v6.6,6.42 | v2.16,29.28 v3.04,30.17 | v6.98,31.95 8.51,30.42 8.89,30.42 ADG3304BRUZ1.2
  Bottom 0.127: v12.57,8.96 12.57,8.45 10.16,6.04 v9.52,6.04 | v6.6,6.42 5.97,6.42 2.16,10.23 v2.16,29.28 | v3.04,30.17 3.55,30.17 5.33,31.95 v6.98,31.95
3_3M2
  Top 0.127: U$1.20 17.4,23.44 17.4,23.69 14.22,26.87 13.84,26.87 11.17,29.53 9.65,29.53 ADG3304BRUZ1.3
3_3RX  (via drill 0.13)
  Top 0.127: v7.62,28.77 7.62,27.25 10.03,24.83 10.03,23.69 8.76,22.42 8.76,20.64 9.01,20.64 U$1.34 | v9.39,32.2 v13.59,32.2 | v19.17,32.33 17.65,30.8 17.65,28.9 17.9,28.64 ADG3304BRUZ2.4
  Bottom 0.127: v7.62,28.77 7.62,30.42 v9.39,32.2 | v13.59,32.2 13.59,33.22 14.35,33.98 14.35,36.14 14.98,36.77 18.28,36.77 19.17,35.88 v19.17,32.33
3_3SERVO1  (via drill 0.13)
  Top 0.127: v14.6,21.79 15.36,22.55 15.36,22.8 U$1.24 | v11.3,21.79 10.66,21.79 v9.9,22.55 | v10.28,28.39 9.65,29.03 ADG3304BRUZ1.4
  Bottom 0.127: v11.3,21.79 v14.6,21.79 | v9.9,22.55 9.27,23.18 9.27,25.22 8.51,25.98 8.38,25.98 8.38,28.01 8.76,28.39 v10.28,28.39
3_3SERVO2  (via drill 0.13)
  Top 0.127: v19.05,10.23 19.05,10.99 U$1.64 | v1.65,26.36 4.82,29.53 8,29.53 8.51,29.03 8.51,28.64 8.89,28.26 ADG3304BRUZ1.5
  Bottom 0.127: v19.05,10.23 19.05,6.29 15.62,2.86 7.62,2.86 1.14,9.34 1.14,25.85 v1.65,26.36
3_3ST1
  Top 0.127: U$1.16 20.82,21.02 20.57,21.02 19.68,21.91 19.68,22.42 20.06,22.8 20.06,28.64 18.79,29.91 ADG3304BRUZ2.2
3_3ST2  (via drill 0.13)
  Top 0.127: v19.81,19.12 20.82,19.12 U$1.12 | v18.79,20.14 18.79,21.91 19.81,22.93 19.81,28.26 18.79,29.28 ADG3304BRUZ2.3
  Bottom 0.127: v18.79,20.14 v19.81,19.12
3_3TX  (via drill 0.13)
  Top 0.127: v16.76,21.91 13.33,18.48 10.54,18.48 10.28,18.74 10.28,20.52 9.9,20.9 9.78,20.9 U$1.33 | v17.01,27.5 17.52,27.5 17.9,27.88 ADG3304BRUZ2.5
  Bottom 0.127: v16.76,21.91 16.76,22.93 17.01,23.18 v17.01,27.5
5RX  (via drill 0.13)
  Top 0.127: v27.68,27.88 26.54,27.88 26.03,28.39 24.76,28.39 ADG3304BRUZ2.11 | v27.68,28.9 26.29,28.9 25.14,30.04 25.14,30.8 24.25,31.69 22.98,31.69 22.6,32.07 22.6,35.12 v22.22,35.5 | v24.63,5.28 24.63,7.31 U$6.3
  Bottom 0.127: v27.68,28.9 v27.68,27.88 | v22.22,35.5 22.6,35.5 23.62,36.52 36.19,36.52 37.59,35.12 40,35.12 43.3,31.82 43.3,8.45 35.94,1.09 28.83,1.09 v24.63,5.28
5ST1  (via drill 0.13)
  Top 0.127: v26.92,26.61 27.17,26.61 28.19,27.63 28.19,28.14 27.94,28.39 26.41,28.39 25.02,29.79 24.76,29.79 ADG3304BRUZ2.13
  Bottom 0.127: v26.92,26.61 27.43,26.61 U$5.5G
5ST2  (via drill 0.13)
  Top 0.127: v21.84,32.45 21.08,31.69 21.08,30.42 22.22,29.28 24,29.28 ADG3304BRUZ2.12
  Bottom 0.127: v21.84,32.45 21.84,33.98 23.87,36.01 34.03,36.01 36.7,33.34 36.7,28.64 35.81,27.76 35.81,26.36 34.92,25.47 34.92,24.2 34.79,24.07 32.25,24.07 31.75,24.58 29.59,24.58 28.57,25.6 U$5.4G
5TX  (via drill 0.13)
  Top 0.127: v25.78,21.41 25.78,26.99 25.02,27.76 24.76,27.76 ADG3304BRUZ2.10 | v23.87,11.12 23.87,10.1 25.27,8.71 U$6.4
  Bottom 0.127: v25.78,21.41 25.78,19.63 25.9,19.5 25.9,18.99 25.14,18.23 24.51,18.23 23.87,17.6 v23.87,11.12
5VCC  (via drill 0.13)
  Top 0.127: JP1.2 37.84,10.23 37.84,10.74 37.08,11.5 37.08,15.82 37.72,16.45 JP1.5 | v21.59,30.68 24,30.68 ADG3304BRUZ2.14 | v18.03,32.71 17.4,32.71 15.74,31.06 ADG3304BRUZ1.14 14.86,31.06 14.6,31.31 v10.28,31.31 | v42.29,32.07 v42.29,20.26 | v35.18,36.01 21.97,36.01 21.59,35.63 v21.59,34.49
  Bottom 0.127: IC3.2 7.87,24.96 6.35,26.49 C16.1 6.35,28.01 7.62,28.01 8.38,28.77 8.38,30.8 8.89,31.31 v10.28,31.31 | v21.59,30.68 20.06,30.68 19.17,31.57 | v18.03,32.71 19.17,31.57 | v42.29,20.26 39.87,17.85 JP1.5 | v42.29,32.07 40.51,33.85 40.51,33.98 39.62,34.87 36.32,34.87 v35.18,36.01 | v21.59,34.49 21.59,33.98 19.17,31.57
ACCX  (via drill 0.13)
  Top 0.127: v18.92,18.61 20.82,18.61 U$1.11 | v4.57,22.17 4.57,21.79 2.66,19.88 2.66,13.53 2.28,13.15 v2.28,9.34
  Bottom 0.127: v18.92,18.61 18.67,18.61 16.38,20.9 5.84,20.9 v4.57,22.17 | v2.28,9.34 2.66,9.34 8.51,3.5 11.43,3.5 13.46,5.53 13.46,5.66 | 13.46,5.66 13.46,6.67 C28.1 | 13.46,5.66 16.63,5.66 17.78,6.8 R10.2
ACCY  (via drill 0.13)
  Top 0.127: v22.09,16.96 22.09,18.99 21.71,19.37 21.46,19.37 U$1.13
  Bottom 0.127: v22.09,16.96 22.09,15.31 C27.1 21.46,14.8 21.08,14.42 20.32,14.42 R8.2
ACCZ  (via drill 0.13)
  Top 0.127: v18.92,12.9 18.41,13.4 18.41,18.87 19.43,19.88 20.82,19.88 U$1.14
  Bottom 0.127: v18.92,12.9 19.68,12.13 R9.2 20.44,11.88 21.59,11.88 C30.1
BSL  (via drill 0.13)
  Top 0.127: v5.46,20.01 8.38,17.09 9.01,17.09 U$1.41 | v6.09,7.05 9.27,7.05 11.3,5.02 12.95,5.02 13.2,5.28 14.73,5.28 R5.2
  Bottom 0.127: SV3.1 4.82,33.6 2.54,31.31 2.54,29.91 2.66,29.79 2.66,22.8 v5.46,20.01 5.33,19.75 2.54,16.96 2.54,10.61 v6.09,7.05
CLK0  (via drill 0.13)
  Top 0.127: v13.33,20.01 13.97,20.64 13.97,22.8 U$1.27
  Bottom 0.127: v13.33,20.01 6.35,20.01 3.55,17.21 3.55,12.64 3.93,12.26 5.97,12.26 6.22,12.52 8,12.52 U$7.3
CLK1  (via drill 0.13)
  Top 0.127: v10.28,15.06 10.28,14.42 9.9,14.04 9.78,14.04 U$1.47
  Bottom 0.127: v10.28,15.06 9.52,15.06 U$7.5
DATAIN0  (via drill 0.13)
  Top 0.127: v12.06,19.5 12.95,20.39 12.95,22.8 U$1.29
  Bottom 0.127: v12.06,19.5 6.22,19.5 3.81,17.09 3.81,13.53 4.19,13.15 U$7.8
DATAIN1  (via drill 0.13)
  Top 0.127: v10.28,15.82 13.46,12.64 13.46,11.75 U$1.53
  Bottom 0.127: v10.28,15.82 9.9,15.82 9.39,16.33 6.09,16.33 5.46,15.69 U$7.6
G1  (via drill 0.13)
  Top 0.127: v17.9,9.72 18.41,9.72 18.67,9.47 19.43,9.47 19.81,9.09 v19.81,8.83 | v20.57,9.59 20.57,13.02 20.44,13.15 20.44,14.8 20.57,14.93 20.82,14.93 U$1.4
  Bottom 0.127: v17.9,9.72 16.76,9.72 U2.1 | v19.81,8.83 v20.57,9.59
G2  (via drill 0.13)
  Top 0.127: v16.63,8.32 16.63,7.44 15.87,6.67 12.95,6.67 12.7,6.93 11.43,6.93 10.41,7.94 10.41,10.74 10.54,10.86 10.54,12.64 9.78,13.4 U$1.48
  Bottom 0.127: v16.63,8.32 15.74,9.21 15.74,9.59 U2.2
GND  (via drill 0.13)
  Top 0.127: 34.39,32.73 34.39,33.49 U$2.2 33.12,34.76 33.12,35.14 | 29.1,19.26 29.05,19.26 U$10.2 29.71,19.25 v30.35,19.25 | U$10.1 28.67,20.53 28.49,20.42 | U$8.2 29.18,14.06 29.01,14.06 | U$3.2 29.05,24.47 28.89,24.47 | 31.42,31.76 31.21,31.96 28.93,31.96 U$2.5 27.66,32.73 27.66,33.49 U$2.1 26.29,33.72 v25.78,33.22 | U$1.42 9.01,16.58 6.85,16.58 5.2,18.23 C14.2 4.95,18.74 4.95,20.26 5.2,20.52 C5.2 5.33,21.41 v6.47,22.55 7.87,23.95 C3.2 | v12.32,24.07 14.6,24.07 14.98,23.69 14.98,23.44 U$1.25 | ADG3304BRUZ1.7 9.65,26.87 v10.92,26.87 v10.92,27.88 | 12.06,9.72 12.06,8.2 C15.2 12.57,8.2 13.33,8.2 | 12.06,9.72 12.06,10.99 U$1.50 | 13.33,8.2 13.71,8.2 16.38,10.86 16.38,10.99 U$1.59 | 12.06,9.72 v10.92,9.72 | v13.33,8.71 13.33,8.2 | U$6.1 22.73,8.71 22.73,11.63 24.13,13.02 C7.2 24.89,13.02 25.4,12.52 v25.4,10.99 25.4,9.59 26.29,8.71 U$6.5 26.29,7.31 26.29,6.17 23.49,3.37 10.92,3.37 10.16,4.13 v10.16,5.28 | v33.4,28.39 33.4,27.5 34.54,26.36 39.49,26.36 40.38,25.47 40.38,24.33 39.37,23.31 37.33,23.31 36.83,22.8 36.83,21.41 37.84,20.39 JP1.6 | 22.6,15.94 24,15.94 24.13,15.82 C6.2 24.89,15.82 27.05,15.82 27.22,15.99 | 22.6,15.94 21.46,15.94 U$1.6 | 18.54,25.34 18.54,26.49 ADG3304BRUZ2.7 | 18.54,25.34 18.54,23.44 U$1.18 | 27.15,20.9 24.89,20.9 C8.2 24.13,21.15 23.62,21.66 23.62,23.18 C4.2 23.62,23.95 v22.73,24.83 | 33.4,32.73 v33.4,32.84 | v19.3,25.34 18.54,25.34 | v22.6,15.82 22.6,15.94 | v27.05,24.96 27.05,23.44 27.15,23.18
  Top 0.61: U$3.1 28.89,25.69 28.89,24.47 28.89,23.22 28.92,23.22 U$3.3 28.93,23.18 27.15,23.18 27.15,20.9 27.15,20.54 27.27,20.42 28.49,20.42 | 29.01,15.38 29.01,15.39 | 29.01,15.38 U$8.1 | U$8.3 29.01,12.84 29.01,14.06 29.01,15.38 | U$10.1 29.01,20.43 29.1,20.43 29.1,19.26 29.1,17.99 U$10.3 28.99,17.89 27.21,17.89 27.17,17.93 27.17,16.04 27.22,15.99 27.91,15.3 28.94,15.3 29.01,15.38 | JP4.2 38.68,36.1 36.81,36.1 36.53,35.81 36.53,32.82 36.24,32.73 34.39,32.73 33.4,32.73 32.38,32.73 31.42,31.76 30.05,30.39 | 30.05,30.39 29.63,29.93 | U$3.2 28.91,24.5 28.91,27.7 29.6,28.38 29.6,29.75 29.94,30.34 30.01,30.34 30.05,30.39
  Bottom 0.127: v12.32,24.07 12.82,24.07 IC1.1 12.82,24.96 v10.92,26.87 | 11.3,27.88 11.05,28.14 11.05,28.39 10.41,29.03 10.28,29.03 C13.2 10.28,30.55 10.79,31.06 10.79,31.57 9.65,32.71 9.14,32.71 7.24,30.8 6.35,30.8 C16.2 5.71,29.28 5.71,28.52 5.46,28.26 4.44,28.26 4.31,28.14 4.31,25.98 5.33,24.96 IC3.1 6.47,23.18 v6.47,22.55 | 11.3,27.88 11.81,27.88 13.59,29.66 C10.2 14.47,30.42 14.47,33.09 14.98,33.6 SV3.5 16.13,34.49 17.52,33.09 17.52,30.42 C9.2 19.3,30.3 21.21,28.39 22.35,28.39 23.87,26.87 25.9,26.87 U$5.7F 26.29,26.36 26.67,25.98 U$5.6G 27.05,25.6 v27.05,24.96 | 11.3,27.88 v10.92,27.88 | 13.46,8.71 13.46,8.45 12.57,7.56 C28.2 12.19,6.67 11.05,5.53 10.16,5.53 | 13.46,8.71 13.46,9.59 U2.4 | 10.16,5.53 9.27,5.53 9.01,5.78 9.01,6.93 C29.2 | v10.92,9.72 10.66,9.98 9.52,9.98 U$7.1 | 13.46,8.71 v13.33,8.71 | 21.08,8.83 21.08,9.85 21.59,10.36 C30.2 | 21.08,8.83 21.08,8.07 C17.2 | 21.08,8.83 23.11,6.8 23.11,6.67 C26.2 | C30.2 22.35,10.86 22.6,11.12 22.6,12.39 22.22,12.77 22.22,13.4 C27.2 22.22,14.04 22.22,14.29 22.6,14.67 v22.6,15.82 | 23.36,9.59 22.35,10.61 C30.2 | 23.36,9.59 24.25,8.71 C22.2 25.02,8.71 25.4,9.09 | 25.4,9.09 25.78,9.47 26.41,9.47 U1.22 | 23.36,9.59 24.76,10.99 v25.4,10.99 26.41,10.99 U1.25 | 25.4,9.09 27.68,6.8 C20.2 28.19,6.04 28.57,5.66 29.84,5.66 30.1,5.91 31.49,5.91 C21.2 | v10.16,5.28 10.16,5.53 | U1.2 33.4,13.02 34.16,13.02 34.92,12.26 C24.1 35.68,12.13 37.33,12.13 JP1.3 40.26,12.39 42.41,12.39 42.8,12.77 42.8,20.52 42.54,20.77 41.02,20.77 40.26,20.01 JP1.6 37.33,19.5 34.67,19.5 34.41,19.25 34.16,19.25 C25.2 34.16,18.48 35.94,16.71 35.94,15.44 35.81,15.31 34.41,15.31 33.78,15.94 33.02,15.94 32,14.93
  Bottom 0.127: U$5.2G 30.35,25.98 30.73,26.36 U$5.1F | C12.1 33.91,24.71 32.76,24.71 31.11,26.36 U$5.1F | U$5.1F 31.11,26.74 34.92,26.74 35.05,26.87 35.05,28.01 34.67,28.39 C18.2 33.91,28.39 v33.4,28.39 | U1.38 31.24,14.55 31.62,14.55 U1.39 31.75,14.55 32.13,14.55 U1.40 32.13,14.8 32,14.93 | 32,14.93 30.6,16.33 30.6,17.98 C23.2 30.35,18.74 v30.35,19.25 | v25.78,33.22 25.78,33.85 C1.2 | v33.4,32.84 33.52,32.96 33.52,33.85 R11.1 | v19.3,25.34 20.32,25.34 20.82,24.83 v22.73,24.83
L_SLEEPMODE_ACC  (via drill 0.13)
  Top 0.127: v19.68,16.96 20.82,16.96 U$1.8
  Bottom 0.127: v19.68,16.96 18.16,15.44 16.76,15.44 U2.12
MOTOR1_GATE  (via drill 0.13)
  Top 0.127: 29.69,17.09 29.69,16.85 U$10.4 | 29.69,17.09 29.69,17.11 | U$3.4 29.69,21.68 29.71,21.66 v30.22,21.66 30.35,21.41 30.86,20.9 30.86,18.23 29.71,17.09 29.69,17.09 | v14.09,28.39 12.57,29.91 12.57,30.42 12.82,30.68 13.33,30.68 13.59,30.42 14.86,30.42 ADG3304BRUZ1.13
  Bottom 0.127: v14.09,28.39 20.82,28.39 27.56,21.66 v30.22,21.66
MOTOR1_NEG
  Top 0.127: U$10.6 34.51,17.99 34.47,17.99 | 34.47,20.66 34.51,20.66 U$10.8 | U$10.7 34.51,19.26 34.47,19.26 | U$3.5 34.51,21.93 34.47,21.93 | U$3.6 34.51,23.2 34.47,23.2 | U$3.7 34.51,24.47 34.47,24.47
  Top 0.61: U$3.8 34.37,25.68 34.47,25.57 | 34.47,16.61 34.47,16.56 | U$10.5 34.47,16.61 | 34.47,16.61 34.47,17.99 34.47,19.26 34.47,20.66 34.47,21.93 34.47,23.2 34.47,24.47 34.47,25.57 | 34.47,25.57 32.72,27.32 31.41,27.32 31.41,27.62 D1.A 31.46,27.73 31.46,30.32 32.65,31.5 37.55,31.5 JP3.2
MOTOR2_GATE  (via drill 0.13)
  Top 0.127: v19.68,33.47 19.55,33.47 15.87,29.79 15.74,29.79 ADG3304BRUZ1.12 | v37.33,5.91 33.91,5.91 32.38,7.44 32.38,8.58 29.71,11.25 U$8.4
  Bottom 0.127: v19.68,33.47 20.82,34.61 20.82,34.74 21.08,34.99 22.48,34.99 23.75,36.26 34.16,36.26 36.95,33.47 36.95,33.22 38.73,31.44 39.87,31.44 43.05,28.26 43.05,8.96 40,5.91 v37.33,5.91
MOTOR2_NEG
  Top 0.127: U$8.6 34.64,12.79 34.55,12.79 | 34.55,13.8 34.51,13.8 U$8.7
  Top 0.61: 34.55,11.49 34.55,11.45 | 34.55,11.49 U$8.5 34.56,10.03 35.41,9.18 35.41,7.23 35.33,7.23 D2.A | 34.55,11.49 34.55,12.79 34.55,13.8 34.55,15.3 U$8.8 34.6,15.35 36.06,15.35 36.14,15.26 36.14,24.29 36.55,24.7 38.48,24.7 JP2.2
N$1  (via drill 0.13)
  Top 0.127: v30.73,15.44 v33.27,15.44 33.27,14.55 33.14,14.42 v33.14,8.32
  Bottom 0.127: 32,7.18 31.62,7.56 30.86,7.56 30.6,7.82 U1.14 | 32,7.18 32.38,6.8 32.38,5.66 30.98,4.26 28.83,4.26 27.17,5.91 25.02,5.91 C26.1 | 29.08,14.93 29.21,14.8 U1.34 | 29.08,14.93 28.57,15.44 27.05,15.44 26.16,14.55 26.16,13.28 26.29,13.15 26.41,13.15 U1.29 | C25.1 35.56,18.48 35.56,17.47 36.19,16.83 36.19,15.31 35.56,14.67 R1.2 34.67,14.04 v33.27,15.44 | 29.08,14.93 29.59,15.44 v30.73,15.44 | 32,7.18 v33.14,8.32
N$2
  Bottom 0.127: C2.2 27.94,33.98 27.94,30.8 U$5.5A
N$3
  Bottom 0.127: C2.1 29.08,33.98 29.08,31.44 28.44,30.8 U$5.4A
N$4
  Bottom 0.127: U$5.7B 26.29,30.04 26.67,30.42 U$5.6A 26.79,30.8 26.79,34.99 26.54,35.25 24.13,35.25 22.98,34.11 22.98,30.68 C11.2
N$5
  Bottom 0.127: C11.1 22.98,29.28 22.98,29.53 24,30.55 24,34.74 24.25,34.99 26.41,34.99 26.54,34.87 26.54,31.31 25.52,30.3 25.52,29.41 25.78,29.15 U$5.7C
N$6  (via drill 0.13)
  Top 0.127: v36.19,29.15 v37.59,29.15 | v32.51,35.25 26.29,35.25 25.27,34.23 v25.27,32.07
  Bottom 0.127: v37.59,29.15 36.83,28.39 36.83,25.72 34.79,23.69 34.67,23.69 C12.2 | v36.19,29.15 36.19,29.91 35.3,30.8 35.3,33.98 34.03,35.25 v32.51,35.25 | v25.27,32.07 25.27,28.9 25.78,28.39 U$5.7D
N$7
  Bottom 0.127: U1.28 26.41,12.64 26.29,12.64 25.9,13.02 25.9,16.2 R7.1
N$8  (via drill 0.13)
  Top 0.127: v1.65,12.9 2.41,13.66 2.41,20.77 4.31,22.68 4.31,26.74 R2.2 | v16.76,4.77 17.52,4.77 LED2.A
  Bottom 0.127: v1.65,12.9 1.65,9.21 7.62,3.24 15.24,3.24 v16.76,4.77
N$9
  Bottom 0.127: U1.3 33.4,12.52 33.78,12.52 34.79,11.5 35.94,11.5 36.32,11.12 36.32,7.44 35.94,7.05 R3.1
N$10
  Top 0.254: 0.13,38.12 0.13,-0.05 44.53,-0.05 44.53,-0.14 44.44,-0.14 44.44,38.12 0.22,38.12
N$11  (via drill 0.13)
  Top 0.127: v31.62,23.56 33.14,25.09 v33.14,25.22
  Bottom 0.127: U$5.1B 30.73,30.04 30.35,30.42 U$5.2A 30.35,30.8 32.25,32.71 | 32.25,32.71 32.25,33.85 R11.2 | v31.62,23.56 31.62,22.55 R12.2 | v33.14,25.22 33.52,25.22 34.79,26.49 35.05,26.49 35.3,26.74 35.3,29.79 35.05,30.04 35.05,31.57 34.67,31.95 C19.1 33.91,32.33 33.14,32.33 32.76,32.71 32.25,32.71
N$12
  Bottom 0.127: C22.1 25.02,9.98 26.41,9.98 U1.23
N$13
  Bottom 0.127: C19.2 33.91,30.68 32.64,30.68 31.11,29.15 U$5.1C
N$15
  Bottom 0.127: C18.1 33.91,27.63 31.62,27.63 31.11,28.14 U$5.1D
N$16
  Bottom 0.127: U1.8 33.4,9.98 33.52,9.98 33.65,9.85 33.65,6.93 33.4,6.67 C21.1
N$18
  Bottom 0.127: U$16.3 21.08,26.36 19.43,28.01 14.47,28.01 14.35,27.88 12.19,27.88 11.68,27.37 10.28,27.37 C13.1 10.28,26.23 10.28,24.96 IC3.3
N$19
  Bottom 0.127: C20.1 29.21,6.8 29.21,7.82 U1.17
N$23
  Bottom 0.127: U$9.3 20.7,20.64 20.7,22.42 20.44,22.68 19.3,22.68 18.79,23.18 IC1.3 18.41,24.96 18.41,26.1 C9.1
N$27
  Bottom 0.127: U2.13 18.03,14.17 18.03,14.93 19.17,16.07 20.57,16.07 20.57,14.93 20.44,14.8 19.3,14.8 18.92,14.42 18.92,13.66 18.41,13.15 18.41,12.01 19.68,10.74 R9.1
N$28
  Bottom 0.127: U2.14 18.03,13.28 18.67,13.91 18.67,14.55 19.55,15.44 R8.1
N$29
  Bottom 0.127: U2.15 18.03,11.88 18.41,11.5 18.41,8.83 17.14,7.56 R10.1
RATEOUTX  (via drill 0.13)
  Top 0.127: v22.98,17.09 22.98,19.12 21.71,20.39 21.46,20.39 U$1.15 | v23.11,12.77 23.11,12.39 22.22,11.5 v22.22,9.72 | v27.05,6.67 29.59,6.67 31.75,4.51 v32.38,4.51
  Bottom 0.127: v22.98,17.09 22.98,16.2 23.11,16.07 v23.11,12.77 | v22.22,9.72 25.02,6.93 26.79,6.93 v27.05,6.67 | v32.38,4.51 33.4,5.53 33.52,5.53 34.67,6.67 34.67,7.56 35.05,7.94 R3.2 35.3,8.83 35.3,10.61 C24.2
RATEOUTY  (via drill 0.13)
  Top 0.127: v19.43,17.98 19.94,17.47 20.82,17.47 U$1.9 | v31.37,20.26 31.37,21.53 v30.48,22.42
  Bottom 0.127: v19.43,17.98 20.82,19.37 21.46,19.37 21.84,19.75 21.84,19.88 22.35,20.39 24,20.39 25.52,21.91 26.03,21.91 27.05,20.9 | 27.05,20.9 27.05,17.09 R7.2 | v31.37,20.26 31.37,18.74 C23.1 | v30.48,22.42 30.48,22.17 30.73,21.91 30.73,21.41 30.22,20.9 27.05,20.9
RATEOUTZ  (via drill 0.13)
  Top 0.127: v20.19,17.98 20.82,17.98 U$1.10 | v25.4,19.25 v27.68,19.25
  Bottom 0.127: v20.19,17.98 22.73,17.98 23.24,18.48 23.75,18.48 24,18.74 24,18.99 24.25,19.25 v25.4,19.25 | v27.68,19.25 29.59,19.25 32.38,22.04 R12.1
RF24G_CE  (via drill 0.13)
  Top 0.127: v10.03,11.88 8.76,13.15 8.76,15.31 8.89,15.44 9.01,15.44 U$1.44
  Bottom 0.127: v10.03,11.88 9.52,11.88 U$7.2
RF24G_CS  (via drill 0.13)
  Top 0.127: v10.79,16.58 9.9,17.47 9.78,17.47 U$1.40
  Bottom 0.127: v10.79,16.58 10.79,14.8 10.41,14.42 9.52,14.42 U$7.4
RST  (via drill 0.13)
  Top 0.127: U$2.3 26.39,30.69 | U$2.3 26.29,30.3 24.51,32.07 U$4.1 24.51,32.96 24.51,33.47 25.02,33.98 25.02,34.36 26.41,35.76 34.67,35.76 34.92,35.5 35.43,35.5 35.68,35.76 35.68,36.26 35.18,36.77 9.27,36.77 8.51,36.01 SV3.2 7.11,34.11 5.33,32.33 5.33,31.44 R4.1 4.44,30.42 4.44,29.66 3.55,28.77 v3.3,28.77 | v36.19,30.68 35.68,30.68 U$2.4 | v29.71,31.44 28.95,30.68 U$2.3 | v15.11,19.25 15.36,18.99 15.36,11.75 U$1.57 | v24.51,18.74 24.51,19.25 C8.1
  Bottom 0.127: v36.19,30.68 36.19,33.47 33.91,35.76 32.25,35.76 29.71,33.22 v29.71,31.44 | v24.51,18.74 24,18.23 23.36,18.23 22.6,17.47 19.17,17.47 18.41,18.23 18.41,18.48 17.65,19.25 v15.11,19.25 14.86,19.37 13.71,20.52 5.46,20.52 3.3,22.68 v3.3,28.77
RX0  (via drill 0.13)
  Top 0.127: v11.55,28.39 13.33,26.61 13.97,26.61 16.89,23.69 16.89,23.44 U$1.21
  Bottom 0.127: v11.55,28.39 11.55,32.71 12.44,33.6 SV3.4
SERVO1  (via drill 0.13)
  Top 0.127: v13.08,30.17 14.09,29.15 14.86,29.15 ADG3304BRUZ1.11 | v5.33,1.59 v32.25,1.59
  Bottom 0.127: v13.08,30.17 13.08,33.09 13.84,33.85 13.84,36.14 12.95,37.03 4.7,37.03 0.63,32.96 0.63,6.29 v5.33,1.59 | v32.25,1.59 37.33,6.67 JP1.1
SERVO2  (via drill 0.13)
  Top 0.127: v16.89,30.04 16,29.15 16,28.64 15.74,28.39 ADG3304BRUZ1.10 | v15.24,31.69 14.86,31.69 13.84,32.71 v8.25,32.71 | v42.8,7.18 42.8,13.28 v42.29,13.79
  Bottom 0.127: v15.24,31.69 v16.89,30.04 | v8.25,32.71 7.87,32.71 6.22,34.36 6.22,36.14 5.58,36.77 4.82,36.77 0.89,32.84 0.89,6.8 6.85,0.83 36.45,0.83 v42.8,7.18 | v42.29,13.79 40.64,13.79 40.26,14.17 JP1.4
SSEL0  (via drill 0.13)
  Top 0.127: v10.79,18.99 11.93,20.14 11.93,22.8 U$1.31 | v5.71,16.96 5.71,15.94 4.57,14.8 4.57,12.77 v3.55,11.75
  Bottom 0.127: v10.79,18.99 6.09,18.99 5.71,18.61 v5.71,16.96 | v3.55,11.75 4.19,11.75 U$7.9
SSEL1  (via drill 0.13)
  Top 0.127: v11.68,15.18 14.47,12.39 14.47,11.75 U$1.55
  Bottom 0.127: v11.68,15.18 9.9,13.4 7.62,13.4 7.36,13.15 6.22,13.15 5.58,13.79 U$7.7
STAT0  (via drill 0.13)
  Top 0.127: v10.66,22.55 10.66,23.31 11.93,24.58 15.49,24.58 16.38,23.69 16.38,23.44 U$1.22 | v5.33,22.17 3.04,19.88 v3.04,13.15 | v11.3,4.13 15.11,4.13 17.27,6.29 17.27,7.44 17.52,7.69 LED2.C
  Bottom 0.127: v10.66,22.55 10.16,22.04 5.46,22.04 v5.33,22.17 | v3.04,13.15 3.04,10.61 6.09,7.56 6.47,7.56 9.9,4.13 v11.3,4.13
TEMP  (via drill 0.13)
  Top 0.127: v30.1,25.09 30.1,23.69 31.87,21.91 31.87,18.87 30.1,17.09 30.1,12.26 28.06,12.26 28.06,13.66 26.92,14.8 26.41,14.8 25.65,14.04 21.46,14.04 U$1.2
  Bottom 0.127: v30.1,25.09 29.84,25.09 29.33,25.6 U$5.3G
TX0  (via drill 0.13)
  Top 0.127: v16.51,28.9 16.51,27.25 17.9,25.85 17.9,23.44 U$1.19 | v16.38,33.47 16,33.47 15.74,33.22 11.81,33.22 11.05,33.98 SV3.3
  Bottom 0.127: v16.51,28.9 16.51,29.66 14.73,31.44 14.73,31.95 16.25,33.47 v16.38,33.47
VCC  (via drill 0.13)
  Top 0.127: v14.73,8.45 14.73,7.94 R5.1 | U$1.51 12.57,11.75 12.32,12.01 11.68,12.01 11.55,11.88 11.55,11.75 U$1.49 11.43,10.99 v11.43,10.36 | v8.51,9.21 8.51,15.56 8.89,15.94 9.01,15.94 U$1.43 | C7.1 24.13,11.75 23.75,11.75 23.36,11.37 23.36,8.71 U$6.2 23.36,7.31 22.73,6.67 v22.48,6.67 22.22,6.8 22.09,6.8 20.32,8.58 | 18.79,12.13 19.05,12.39 19.17,12.39 19.55,12.77 | 18.79,12.13 18.54,11.88 18.54,11.75 U$1.63 | 19.55,12.77 20.19,13.4 20.19,16.07 20.57,16.45 20.82,16.45 U$1.7 21.46,16.45 22.35,16.45 22.48,16.58 24.13,16.58 C6.1 | 16.25,22.42 16.13,22.55 16.13,22.8 U$1.23 | 16.25,22.42 17.01,22.42 18.16,21.28 18.16,12.77 18.79,12.13 | 20.32,8.58 20.32,9.09 19.55,9.85 19.55,12.77 | v10.79,4.77 10.79,3.88 11.05,3.63 18.54,3.63 20.32,5.4 20.32,8.58 | C5.1 7.11,21.41 9.65,23.95 C3.1 9.14,24.45 6.85,26.74 R2.1 6.09,27.63 6.09,27.88 v5.2,28.77 | 6.47,32.2 6.47,31.44 R4.2 | 6.47,32.2 6.73,32.45 7.49,32.45 | 7.49,32.45 8.89,31.06 ADG3304BRUZ1.1 9.65,30.8 10.28,30.8 13.97,27.12 14.86,27.12 ADG3304BRUZ1.8 15.36,26.87 v15.87,26.36 | v3.68,31.06 v3.68,29.66 | 6.47,32.2 v6.22,32.45 | 19.43,31.31 21.08,32.96 U$4.3 21.08,33.85 20.95,33.98 18.67,33.98 SV3.6 17.4,33.72 16.63,32.96 11.68,32.96 11.43,33.22 8,33.22 7.49,32.71 7.49,32.45 | 19.43,31.31 18.79,30.68 ADG3304BRUZ2.1 | 23.62,26.49 22.22,25.09 22.22,23.95 C4.1 | 23.62,26.49 24,26.49 ADG3304BRUZ2.8 24.76,26.49 v25.27,25.98 | 22.98,27.76 23.62,27.12 23.62,26.49 | 19.43,31.31 22.98,27.76 | 22.98,27.76 v23.36,28.14 | 16.25,22.42 v16,22.17
  Bottom 0.127: U2.3 14.73,9.59 v14.73,8.45 14.47,8.32 13.71,8.32 13.08,7.69 13.08,6.55 11.3,4.77 v10.79,4.77 9.65,4.77 8.38,6.04 8.38,8.96 v8.51,9.21 | v8.51,9.21 10.03,7.69 C29.1 10.54,7.69 11.43,8.58 v11.43,10.36 | U$7.10 5.58,9.98 5.58,9.85 6.09,9.34 8.25,9.34 v8.51,9.21 | v22.48,6.67 21.08,6.67 C17.1 | v15.87,26.36 15.36,26.36 C10.1 15.11,26.1 15.11,24.96 IC1.2 16,23.18 v16,22.17 | v5.2,28.77 4.57,28.77 v3.68,29.66 | v3.68,31.06 4.06,31.06 5.46,32.45 v6.22,32.45 | 24.76,28.52 24.76,33.85 C1.1 | 24.76,28.52 25.78,27.5 U$5.7E 27.05,27.37 27.94,27.37 29.08,28.52 29.08,29.53 U$5.3A | v25.27,25.98 26.92,24.33 31.62,24.33 33.27,22.68 33.27,18.23 34.67,16.83 34.67,16.45 R1.1 | 24.76,28.52 23.75,28.52 v23.36,28.14
VCCBATTERY  (via drill 0.13)
  Top 0.127: 37.18,27.63 37.18,27.65 JP3.1 | v22.48,22.17 22.48,20.01 v24.76,17.72 | v25.9,12.26 30.35,7.82 D2.C
  Top 0.61: D1.C 34.12,27.62 34.13,27.63 37.18,27.63 38.18,27.63 | JP3.1 38.43,27.62
  Top 1.016: JP4.1 38.76,33.55 41.22,33.55 41.31,33.46 41.31,27.85 | 41.31,22.64 41.31,22.36 41.23,22.44 38.76,22.44 JP2.1 | 41.31,22.64 41.31,27.85 | 41.31,27.85 41.39,27.85 | JP3.1 41.31,27.85 | D2.C 33.89,4.45 40.55,4.45 41.32,5.22 41.32,22.64 41.31,22.64
  Bottom 0.127: U$16.1 22.48,22.93 v22.48,22.17 22.48,21.53 U$9.1 | v24.76,17.72 24.76,13.4 v25.9,12.26
VREF_X_Y  (via drill 0.13)
  Top 0.127: v16.89,21.15 15.62,19.88 15.62,15.82 16.89,14.55 16.89,11.75 U$1.60 | v10.92,25.85 9.39,25.85 8.12,27.12 8.12,29.03 7.87,29.28 4.95,29.28 2.16,26.49 2.16,20.39 1.14,19.37 1.14,6.8 4.95,2.99 40.26,2.99 42.29,5.02 v42.29,13.02 | v32.76,14.8 32.76,14.55 30.22,12.01 27.94,12.01 26.67,13.28 v26.67,14.29
  Bottom 0.127: v16.89,21.15 16,21.15 14.35,22.8 12.7,22.8 11.55,23.95 11.55,25.22 v10.92,25.85 | v42.29,13.02 34.54,13.02 v32.76,14.8 | v26.67,14.29 27.3,14.93 27.3,15.06 27.43,15.18 27.81,15.18 28.19,14.8 U1.32
XTAL1  (via drill 0.13)
  Top 0.127: v15.74,8.45 17.9,10.61 17.9,10.99 U$1.62 | v13.97,6.17 13.71,6.17 12.82,5.28 11.43,5.28 9.39,7.31 6.6,7.31 6.35,7.56 5.84,7.56 4.57,6.29 U$13.3 3.55,6.29 3.04,6.8 3.04,12.01 4.31,13.28 4.31,16.07 C14.1
  Bottom 0.127: v15.74,8.45 15.74,7.94 v13.97,6.17
XTAL2  (via drill 0.13)
  Top 0.127: v16.13,16.07 17.4,14.8 17.4,11.75 U$1.61 | v10.03,11.12 10.03,9.59 9.01,8.58 U$13.1 9.01,8.07 10.54,6.55 11.68,6.55 C15.1
  Bottom 0.127: v16.13,16.07 13.46,16.07 10.54,13.15 10.54,11.63 v10.03,11.12

### Text on the board
_tsilk: SV3 | 6 | 1 | R4 | ADG3304BRUZ1 | ADG3304BRUZ2 | U$4 | JP4 | U$2 | U$3 | D1 | JP3 | R2 | 8 | C3 | C4 | U$10 | JP2 | C5 | C8 | 8 | C14 | C6 | U$8 | U$1 | 8 | C7 | U$7 | D2 | R5 | C15 | LED2 | JP1 | U$13 | U$6
_bsilk: C2 | R11 | C1 | U$5 | C19 | C11 | C16 | C18 | C13 | C10 | C9 | U$16 | C12 | R12 | U$9 | C25 | C23 | IC3 | IC1 | R8 | R7 | U1 | R1 | C27 | C30 | C24 | R9 | C22 | C29 | C28 | U2 | R10 | C17 | C26 | C20 | C21 | R3